# EAGLE design placa_sensor2 (EAGLE 6.5.0)
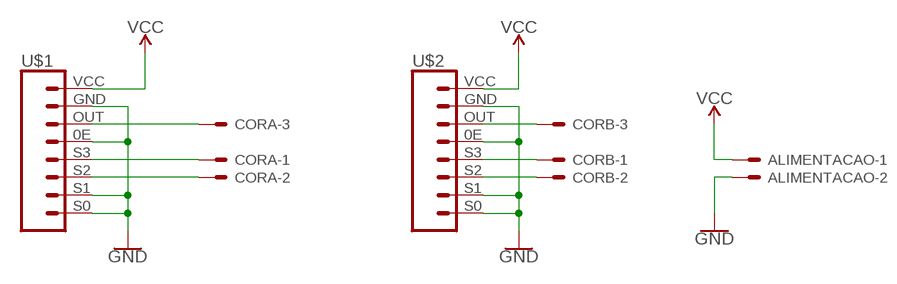
[diagram p0: schematic, sheet 1]

## Parts
ALIMENTACAO  22-05-7028-02  [7395-02]
CORA  22-05-7038-03  [7395-03]
CORB  22-05-7038-03  [7395-03]
U$1  TCS3200_2TCS3200_2  [TCS3200_2]
U$2  TCS3200_2TCS3200_2  [TCS3200_2]

## Nets
GND: ALIMENTACAO.2 U$1.0E U$1.GND U$1.S0 U$1.S1 U$2.0E U$2.GND U$2.S0 U$2.S1
N$1: CORA.2 U$1.S2
N$2: CORB.1 U$2.S3
N$3: CORB.2 U$2.S2
N$4: CORA.3 U$1.OUT
N$5: CORA.1 U$1.S3
N$6: CORB.3 U$2.OUT
VCC: ALIMENTACAO.1 U$1.VCC U$2.VCC

## Library data of the parts
ALIMENTACAO = con-molex:22-?-02: CONNECTOR wire to board 2.54 mm (.1 inch) pitch header; OC_FARNELL: 9731601; OC_NEWARK: unknown
CORA CORB = con-molex:22-?-03: CONNECTOR wire to board 2.54 mm (.1 inch) pitch header; OC_FARNELL: unknown; OC_NEWARK: unknown
U$1 U$2 = Robotica-IFRN-SC:TCS3200_2

## Board
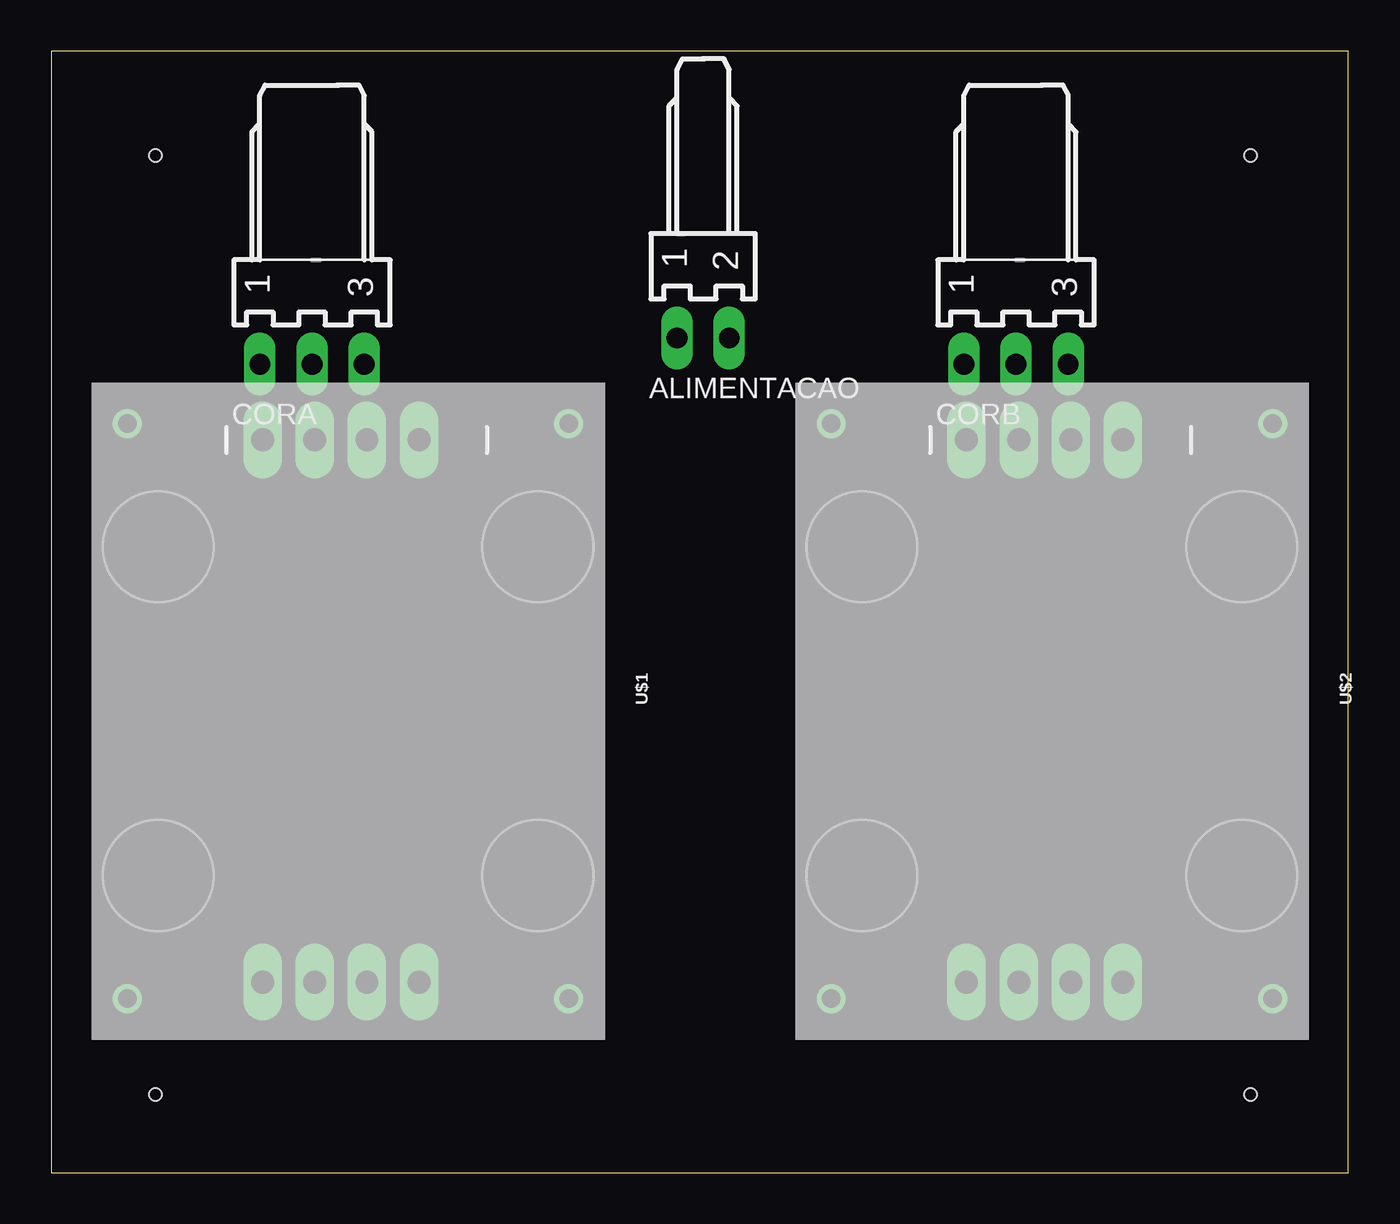
[diagram p1: board, top side]
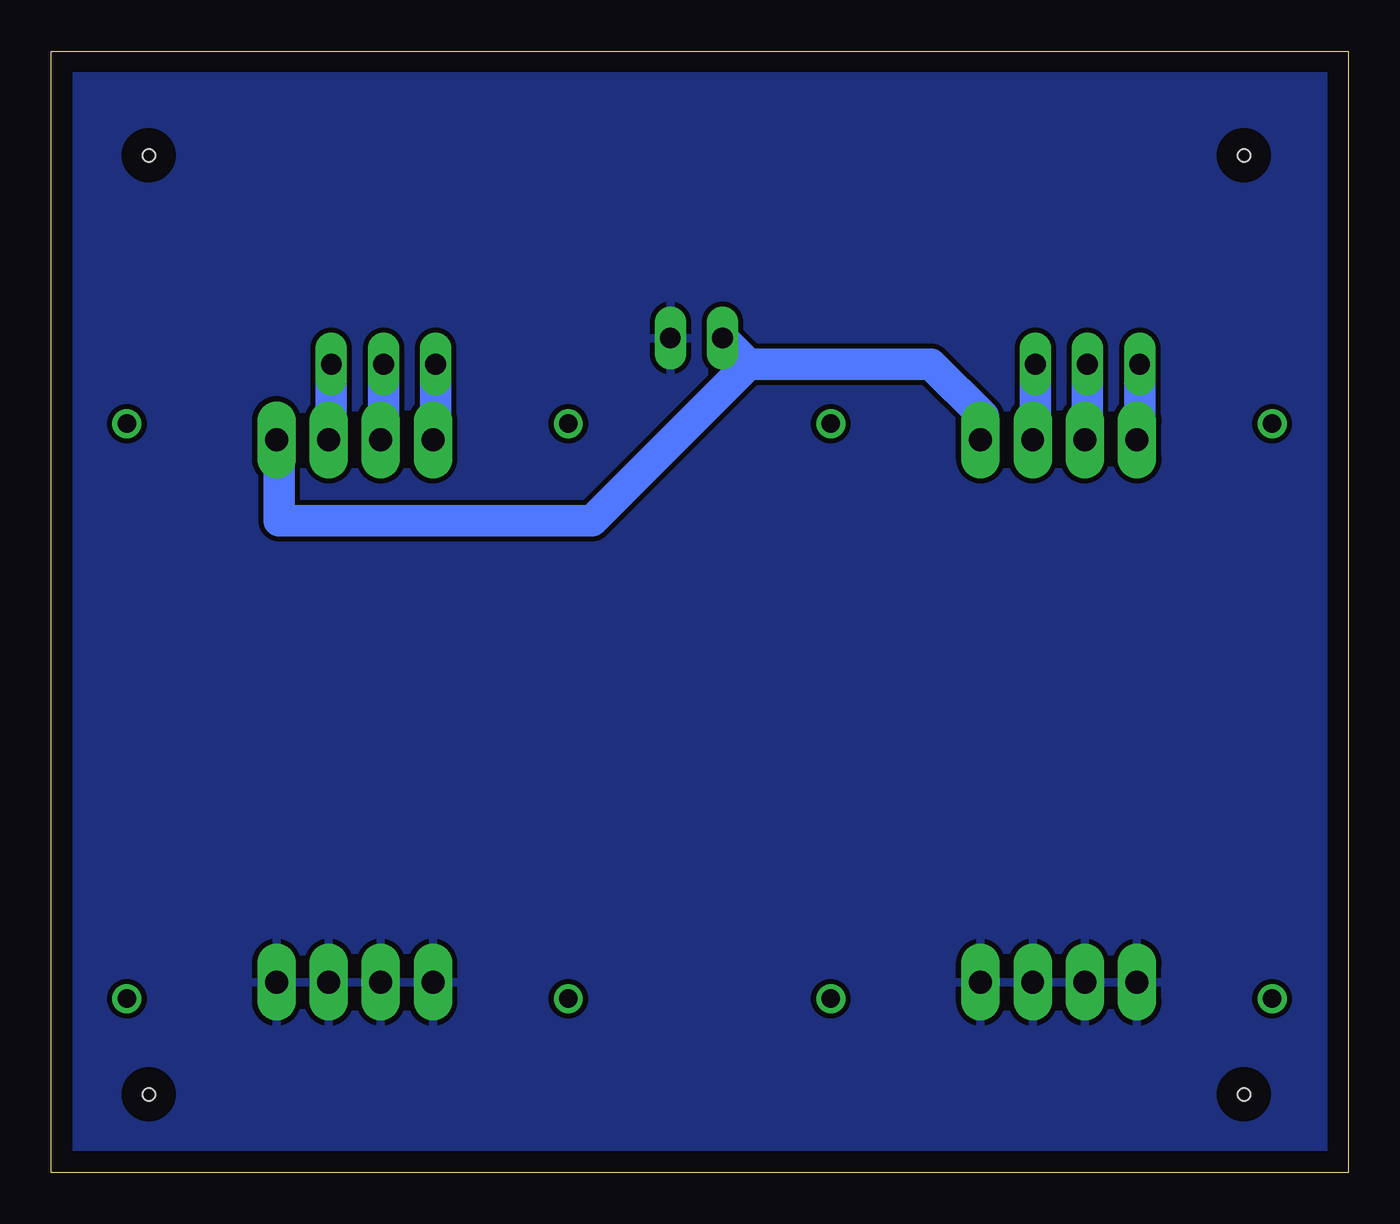
[diagram p2: board, bottom side, seen from below]

Size 63.17 x 54.6 mm. Coordinates in mm from the lower left corner, seen from the top.
Outline: 0,0 63.17,0 63.17,54.6 0,54.6 0,0
Copper layers (1*16): Top 0.035mm / dielectric 1.5mm / Bottom 0.035mm
Design rules "default *": minimum track width 60mil, minimum drill 24mil, track to track 10mil, track to pad 10mil, pad to pad 10mil, via to via 10mil, smd to smd 8mil, copper to edge 40mil, drill to drill 8mil, minimum pad ring 10mil, minimum via ring 8mil, stop-mask expansion 4mil, vias tented up to drill 0mil, thermal gap 10mil
Holes 0.6 mm at 5.08,49.53 58.42,49.53 58.42,3.81 5.08,3.81

### Footprints (pad centres in the part's own frame; a part is rotated, then mirrored left to right if it is on the bottom)
7395-02 = drill 1.016 long: 1 1.27,0; 2 -1.27,0
7395-03 = drill 1.016 long: 1 2.54,0; 2 0,0; 3 -2.54,0
TCS3200_2 = drill 1.118 pad 1.88 long: 0E -4.69,-2.67; GND -4.69,-5.21; OUT 21.71,-2.67; S0 -4.69,2.41; S1 -4.69,-0.13; S2 21.71,-0.13; S3 21.71,2.41; VCC 21.71,-5.21 | drill 0.9: P$1 -5.5,9; P$2 -5.5,-12.5; P$3 22.5,-12.5; P$4 22.5,9

### Placement (x,y rotation side)
ALIMENTACAO  31.75,40.64 180 top
CORA  12.7,39.37 180 top
CORB  46.99,39.37 180 top
U$1  12.7,13.97 90 top
U$2  46.99,13.97 90 top

### Tracks (layer width: path | path; a pad name or v marks a point on that pad's centre or on a via)
GND
  pour Bottom: 0,54.61 62.23,54.61 62.23,1.27 0,1.27
N$1
  Bottom 1.524: CORA.2 12.7,36.83 U$1.S2
N$2
  Bottom 1.524: CORB.1 44.45,36.83 U$2.S3
N$3
  Bottom 1.524: CORB.2 46.99,36.83 U$2.S2
N$4
  Bottom 1.524: CORA.3 15.24,36.83 U$1.OUT
N$5
  Bottom 1.524: CORA.1 10.16,36.83 U$1.S3
N$6
  Bottom 1.524: CORB.3 49.53,36.83 U$2.OUT
VCC
  Bottom 1.524: 29.21,39.37 ALIMENTACAO.1 | 29.21,39.37 20.32,39.37 17.78,36.83 U$1.VCC | 29.21,39.37 36.83,31.75 52.07,31.75 52.07,35.56 U$2.VCC